# Altium schematic sheet S7CAS-PLEIADES-CARTE-MERE_P20_ADC-DAC.SchDoc
size Tabloid; Sheet_Name: Insert name in Document Parameters; Size: 11x17
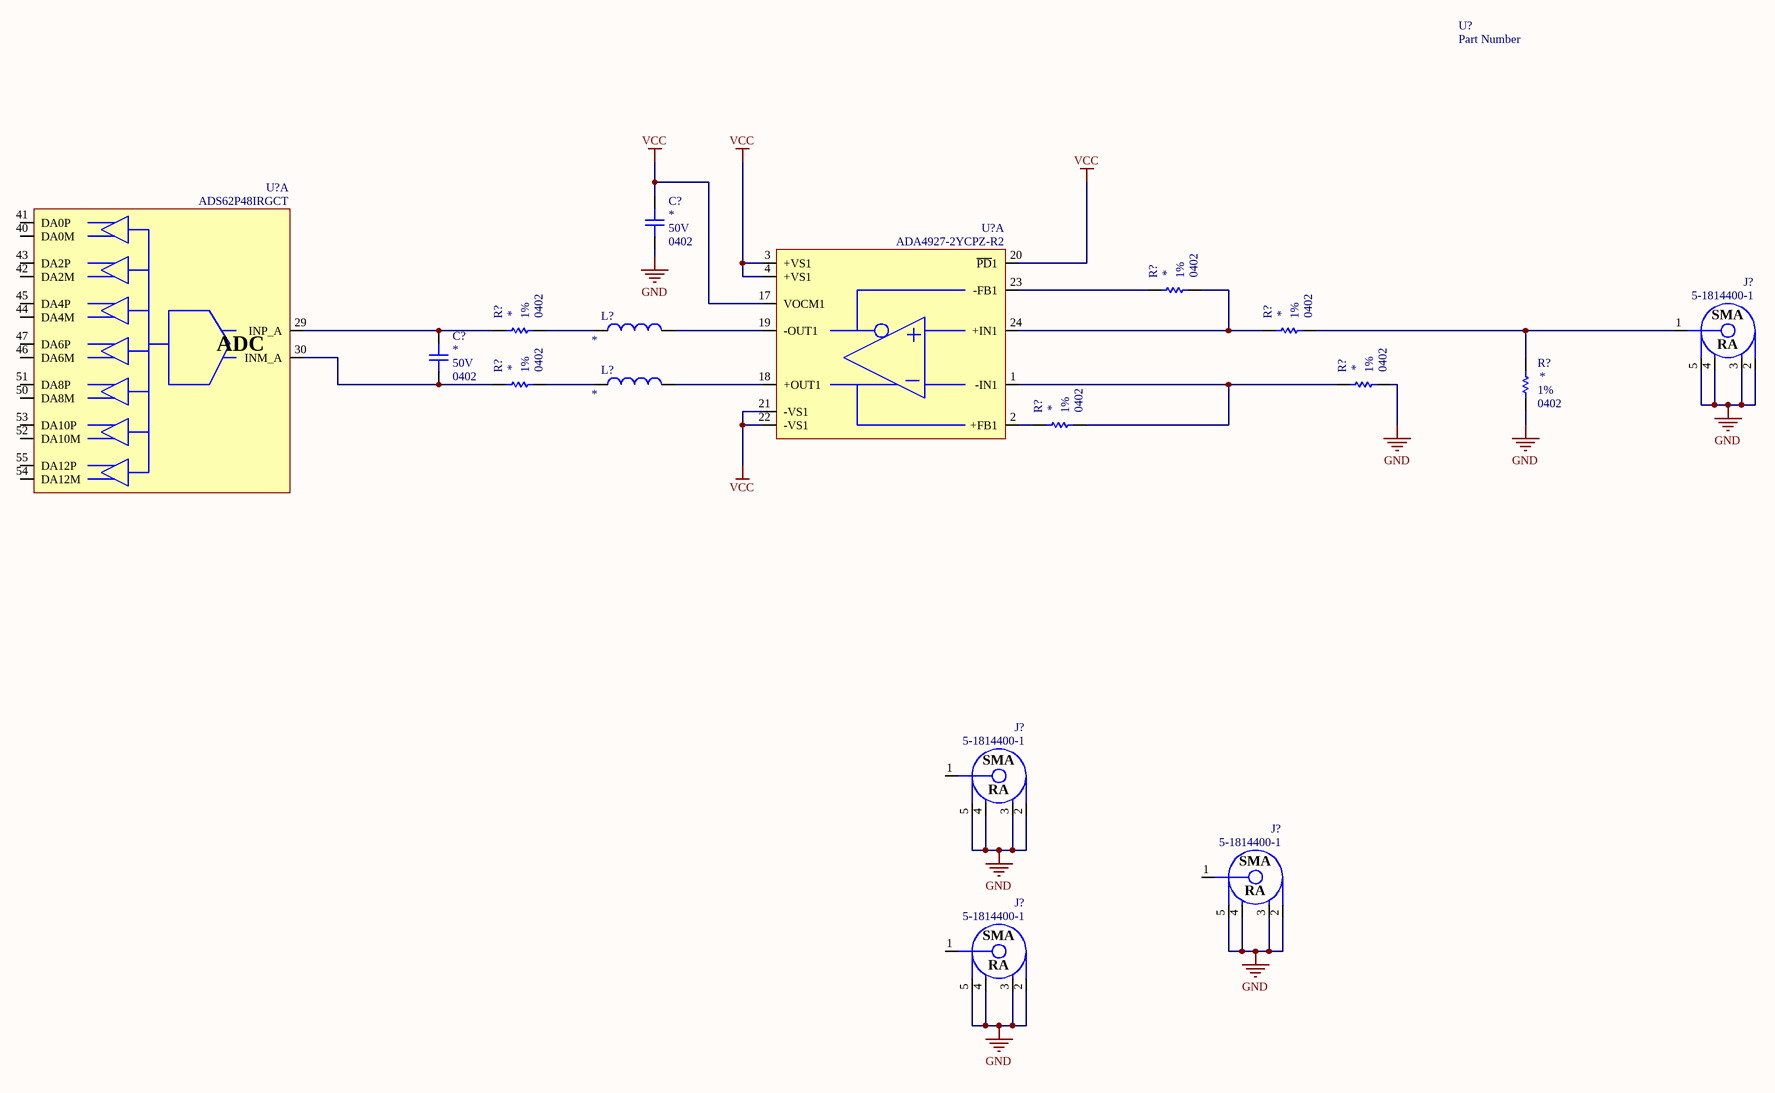
[diagram p0: S7CAS-PLEIADES-CARTE-MERE_P20_ADC-DAC.SchDoc]

## Parts
(Parts that share a designator on the sheet are numbered #1, #2 ... from top to bottom, then left to right.)
C?#1  Voltage: 50V  Package: 0402  [CAP_0402]  (hidden comment: CAP - 0402)
C?#2  Voltage: 50V  Package: 0402  [CAP_0402]  (hidden comment: CAP - 0402)
J?#1  5-1814400-1  [CONN_SMA_5-1814400-1]
J?#2  5-1814400-1  [CONN_SMA_5-1814400-1]
J?#3  5-1814400-1  [CONN_SMA_5-1814400-1]
J?#4  5-1814400-1  [CONN_SMA_5-1814400-1]
L?#1  Part Number  (value not drawn)
L?#2  Part Number  (value not drawn)
R?#1  Package: 0402  Precision: 1%  [RES_0402]  (hidden comment: RES - 0402)
R?#2  Package: 0402  Precision: 1%  [RES_0402]  (hidden comment: RES - 0402)
R?#3  Package: 0402  Precision: 1%  [RES_0402]  (hidden comment: RES - 0402)
R?#4  Package: 0402  Precision: 1%  [RES_0402]  (hidden comment: RES - 0402)
R?#5  Package: 0402  Precision: 1%  [RES_0402]  (hidden comment: RES - 0402)
R?#6  Package: 0402  Precision: 1%  [RES_0402]  (hidden comment: RES - 0402)
R?#7  Package: 0402  Precision: 1%  [RES_0402]  (hidden comment: RES - 0402)
U?#1  Part Number
U?#2  ADS62P48IRGCT  [ADC_ADS62P48IRGCT]  (part A of 4)
U?#3  ADA4927-2YCPZ-R2  [OPAMP_ADA4927-2YCPZ-R2]  (part A of 2)

## Nets
GND: C?#1.1 J?#1.2 J?#1.3 J?#1.4 J?#1.5 J?#2.2 J?#2.3 J?#2.4 J?#2.5 J?#3.2 J?#3.3 J?#3.4 J?#3.5 J?#4.2 J?#4.3 J?#4.4 J?#4.5 R?#5.1 R?#6.1
VCC: C?#1.2 U?#3.3(+VS1) U?#3.4(+VS1) U?#3.17(VOCM1) U?#3.20(~{PD}1) U?#3.21(-VS1) U?#3.22(-VS1)
NetC?#2_1: C?#2.1 R?#4.2 U?#2.30(INM_A)
NetC?#2_2: C?#2.2 R?#2.2 U?#2.29(INP_A)
NetJ?#1_1: J?#1.1 R?#3.1 R?#6.2
NetL?#1_0: L?#1.0 R?#2.1
NetL?#1_1: L?#1.1 U?#3.19(-OUT1)
NetL?#2_0: L?#2.0 R?#4.1
NetL?#2_1: L?#2.1 U?#3.18(+OUT1)
NetR?#1_1: R?#1.1 R?#3.2 U?#3.24(+IN1)
NetR?#1_2: R?#1.2 U?#3.23(-FB1)
NetR?#5_2: R?#5.2 R?#7.1 U?#3.1(-IN1)
NetR?#7_2: R?#7.2 U?#3.2(+FB1)

Not connected (* = marked no-connect by the designer): J?#2 1; J?#3 1; J?#4 1; U?#2 40(DA0M) 41(DA0P) 42(DA2M) 43(DA2P) 44(DA4M) 45(DA4P) 46(DA6M) 47(DA6P) 50(DA8M) 51(DA8P) 52(DA10M) 53(DA10P) 54(DA12M) 55(DA12P)

## Notes on the sheet
- Sheet Name
- Project Title
- Global Project
- Size
- Group
- Revision
- Date
- Sheet
- of
- Filename
- Designers
- (in symbol ADC_ADS62P48IRGCT, part A) ADC
- (in symbol CONN_SMA_5-1814400-1) SMA; RA

## Library data of the parts
C?#1 C?#2 = CAP - 0402: Precision: 10%; Current: *; CreatedBy: Jonathan Bouchard; Power: *; Value: *
J?#1-J?#4 = CONN_SMA_5-1814400-1: CONN -  SMA JACK R/A 50 OHM - TH; Mfg: TE Connectivity AMP Connectors; Voltage: *; Current: *; Power: *; Mfg Part Number: 5-1814400-1; HelpURL: http://www.te.com/commerce/DocumentDelivery/DDEController?Action=srchrtrv&DocNm=1814400&DocType=Customer+Drawing&DocLang=English; CreatedBy: Jonathan Bouchard; Temperature: -55°C ~ 85°C; Value: *; Precision: *; Package: TH-5; Supplier 1: Digikey; Supplier Part Number 1: A97593-ND
L?#1 L?#2 = IND: XXX - Description - Package; GRAMS Lib Spec: 2.7; Voltage: *
R?#1-R?#7 = RES - 0402: Voltage: 50V; Power: 1/16W; Current: *; CreatedBy: Jonathan Bouchard; Value: *
U?#1 = Component_1: XXX - Description - Package; GRAMS Lib Spec: 2.7
U?#2 = ADC_ADS62P48IRGCT: ADC - 14 BIT 210MSPS SUAL - VQFN-64; Voltage: 3.15 V ~ 3.6 V / 1.7 V ~ 1.9 V; Mfg: Texas Instruments; Precision: 14 Bit; Current: *; Power: *; Mfg Part Number: ADS62P48IRGCT; HelpURL: http://www.ti.com/lit/ds/symlink/ads62p48.pdf; CreatedBy: Jonathan Bouchard; Temperature: -40°C ~ 85°C; Value: *; Package: VQFN-64; Supplier 1: Digikey; Supplier Part Number 1: 296-24611-1-ND
U?#3 = OPAMP_ADA4927-2YCPZ-R2: OPAMP - CFA 2.3GHZ - QFN-24; Voltage: 4.5 V ~ 11 V, ±2.25 V ~ 5.5 V; Current: 65mA; Mfg: Analog Devices; Power: *; Mfg Part Number: ADA4927-2YCPZ-R2; HelpURL: http://www.analog.com/media/en/technical-documentation/data-sheets/ADA4927-1_4927-2.pdf; CreatedBy: Jonathan Bouchard; Temperature: -40°C ~ 105°C; Value: *; Precision: *; Package: QFN-24; Supplier 1: Digikey; Supplier Part Number 1: ADA4927-2YCPZ-R2CT-ND